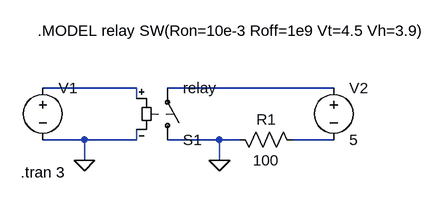
[diagram p0: schematic RelayTest.asc]
RelayTest.asc, the LTspice schematic file:
Version 4
SHEET 1 880 680
WIRE 80 144 -64 144
WIRE 384 144 128 144
WIRE 80 160 80 144
WIRE 0 224 -64 224
WIRE 80 224 80 208
WIRE 80 224 0 224
WIRE 208 224 128 224
WIRE 240 224 208 224
WIRE 384 224 320 224
WIRE 0 256 0 224
WIRE 208 256 208 224
FLAG 0 256 0
FLAG 208 256 0
SYMBOL sw 128 240 M180
SYMATTR InstName S1
SYMATTR Value relay
SYMBOL voltage -64 128 R0
WINDOW 3 24 96 Invisible 2
WINDOW 123 0 0 Left 2
WINDOW 39 0 0 Left 2
SYMATTR InstName V1
SYMATTR Value PWL(0 0 1 20 2 0)
SYMBOL voltage 384 128 R0
WINDOW 123 0 0 Left 2
WINDOW 39 0 0 Left 2
SYMATTR InstName V2
SYMATTR Value 5
SYMBOL res 224 208 M90
WINDOW 0 0 56 VBottom 2
WINDOW 3 32 56 VTop 2
SYMATTR InstName R1
SYMATTR Value 100
TEXT -72 56 Left 2 !.MODEL relay SW(Ron=10e-3 Roff=1e9 Vt=4.5 Vh=3.9)
TEXT -98 274 Left 2 !.tran 3

The netlist it stands for:
* RelayTest.asc
S1 0 N002 N001 0 relay
V1 N001 0 PWL(0 0 1 20 2 0)
V2 N002 N003 5
R1 0 N003 100
.MODEL relay SW(Ron=10e-3 Roff=1e9 Vt=4.5 Vh=3.9)
.tran 3
.backanno
.end